# EAGLE design NinjaScanSlim (EAGLE 4.16)
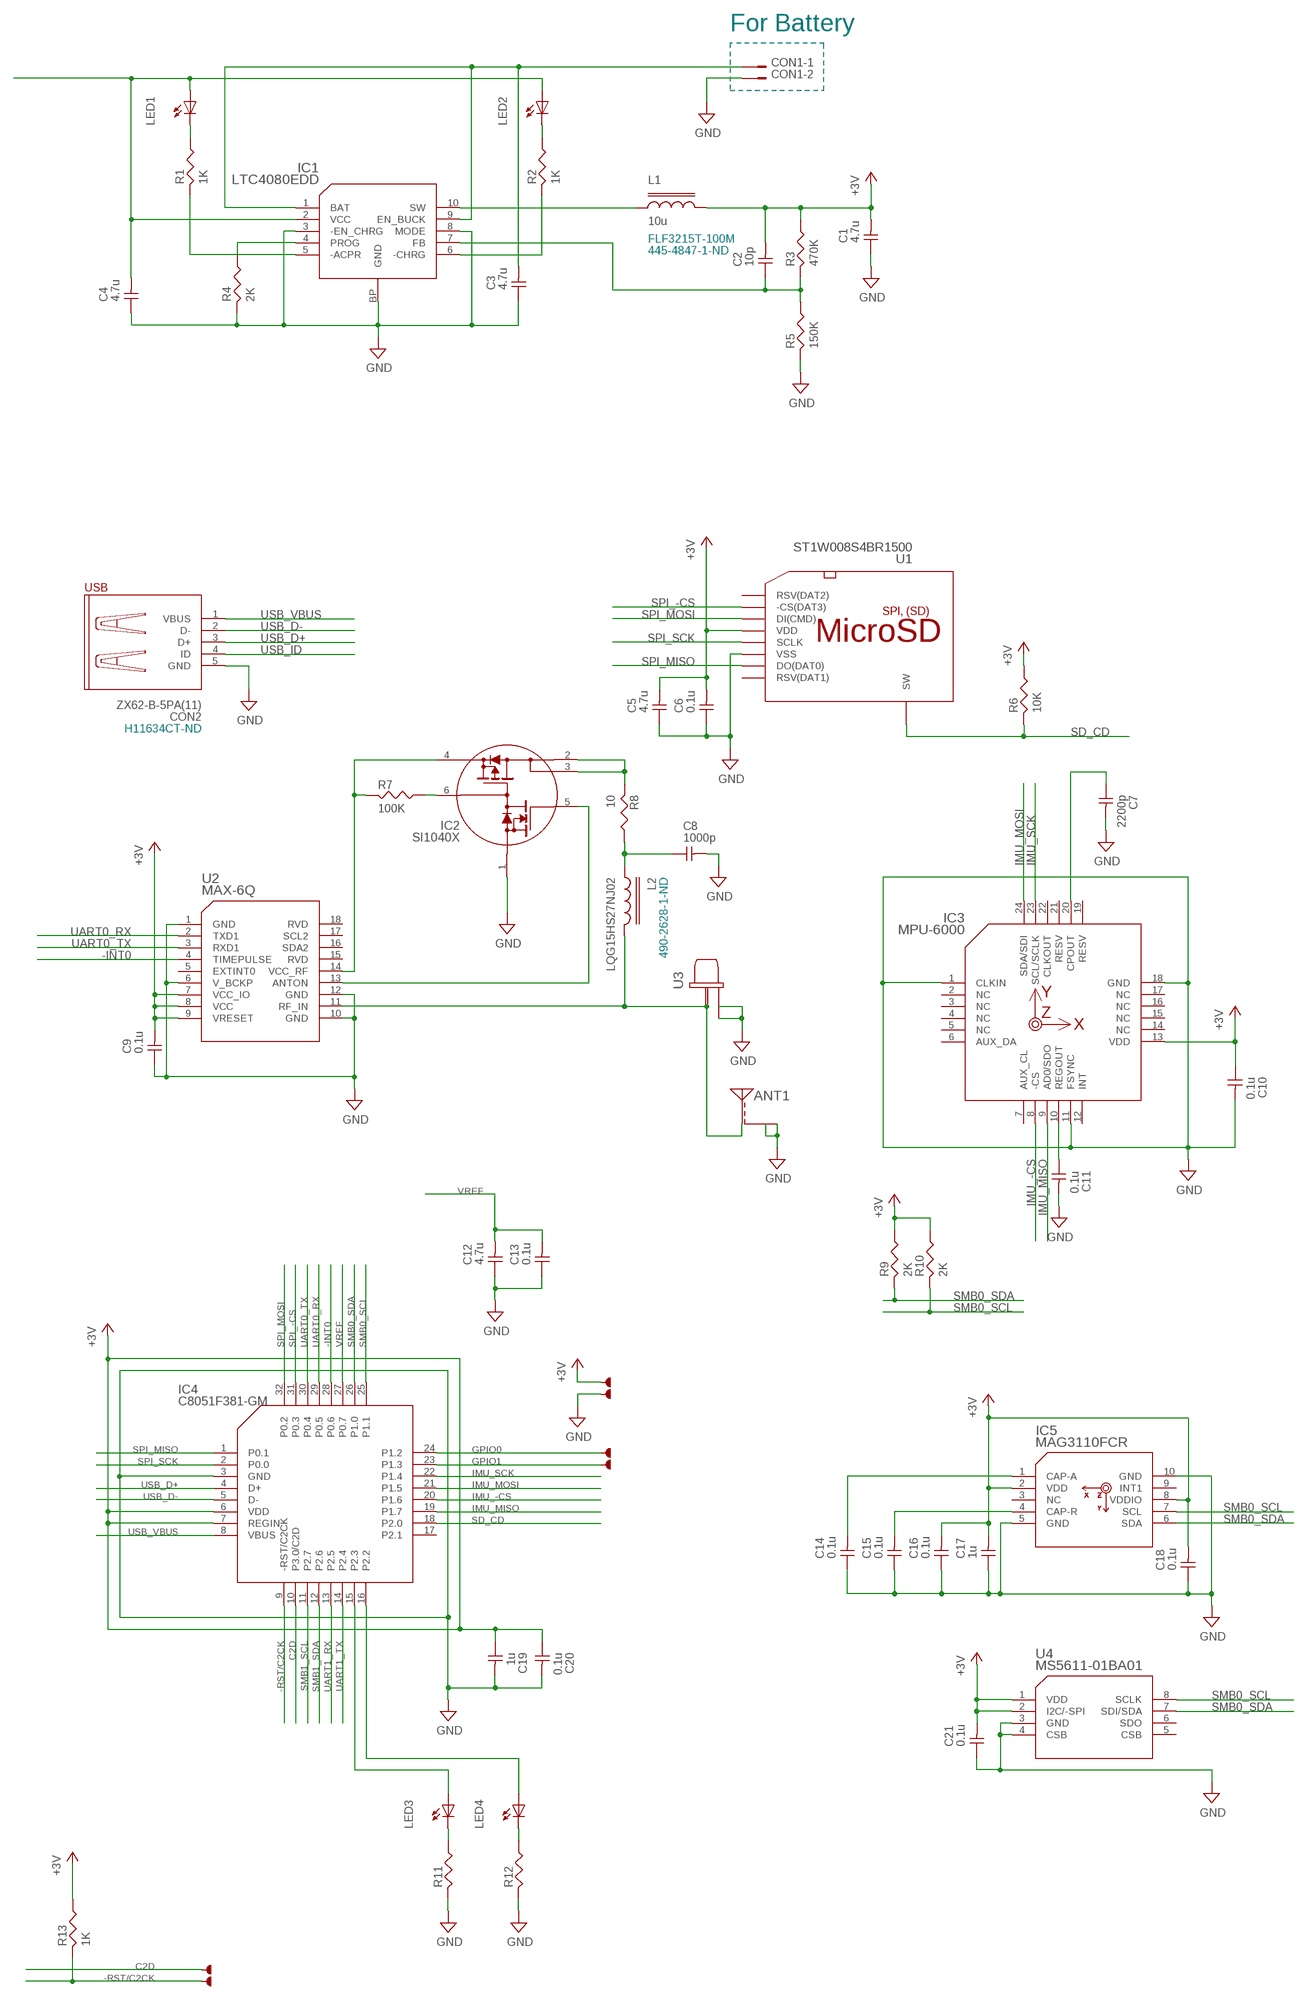
[diagram p0: schematic, sheet 1]

## Parts
ANT1  W3011A(M)  [W3011A-MIRROR]
C1  4.7u  C1608  [1608]
C2  10p  C1005  [1005]
C3  4.7u  C1608  [1608]
C4  4.7u  C1608  [1608]
C5  4.7u  C1608  [1608]
C6  0.1u  C1005  [1005]
C7  2200p  C1005  [1005]
C8  1000p  C1005  [1005]
C9  0.1u  C1005  [1005]
C10  0.1u  C1005  [1005]
C11  0.1u  C1005  [1005]
C12  4.7u  C1608  [1608]
C13  0.1u  C1005  [1005]
C14  0.1u  C1005  [1005]
C15  0.1u  C1005  [1005]
C16  0.1u  C1005  [1005]
C17  1u  C1005  [1005]
C18  0.1u  C1005  [1005]
C19  1u  C1005  [1005]
C20  0.1u  C1005  [1005]
C21  0.1u  C1005  [1005]
CON1  JST_ZH-2B(MM)  [JST_ZH-2B(MM)]
CON2  ZX62-B-5PA(11)  ZX62-AB-5PA  [ZX62-AB-5PA]
IC1  LTC4080EDD  [DFN10BP]
IC2  SI1040X  [SC89-6]
IC3  MPU-6000  [QFN24]
IC4  C8051F381-GM  C8051F341_32-GM  [QFN32]
IC5  MAG3110FCR  [DFN10]
L1  10u  L3225  [3225]
L2  LQG15HS27NJ02  L1005  [1005]
LED1  LED1608  [1608D]
LED2  LED1608  [1608D]
LED3  LED1608  [1608D]
LED4  LED1608  [1608D]
PAD1  PAD(20X20)  [PAD_20X20]
PAD2  PAD(20X20)  [PAD_20X20]
PAD3  PAD(20X20)  [PAD_20X20]
PAD4  PAD(20X20)  [PAD_20X20]
PAD5  PAD(40X40)  [PAD_40X40]
PAD6  PAD(40X40)  [PAD_40X40]
R1  1K  R1005  [1005]
R2  1K  R1005  [1005]
R3  470K  R1005  [1005]
R4  2K  R1005  [1005]
R5  150K  R1005  [1005]
R6  10K  R1005  [1005]
R7  100K  R1005  [1005]
R8  10  R1005  [1005]
R9  2K  R1005  [1005]
R10  2K  R1005  [1005]
R11  R1005  [1005]
R12  R1005  [1005]
R13  1K  R1005  [1005]
U1  ST1W008S4BR1500  [ST1W008S4BR1500]
U2  MAX-6Q  [MAX]
U3  U.FL  [U.FL]
U4  MS5611-01BA01  [LGA8]

## Nets
+3V: C1.P$2 C2.P$2 C5.P$2 C6.P$2 C9.P$2 C10.P$1 C16.P$2 C17.P$2 C18.P$2 C19.P$1 C20.P$1 C21.P$2 IC3.13(VDD) IC4.6(VDD) IC4.7(REGIN) IC5.2(VDD) IC5.8(VDDIO) L1.2 PAD1.P R3.P$1 R6.P$1 R9.P$1 R10.P$1 R13.P$1 U1.4(VDD) U2.7(VCC_IO) U2.8(VCC) U2.9(VRESET) U4.1(VDD) U4.2(I2C/-SPI)
-INT0: IC4.28(P0.6) U2.4(TIMEPULSE)
-RST/C2CK: IC4.9(-RST/C2CK) PAD6.P R13.P$2
C2D: IC4.10(P3.0/C2D) PAD5.P
GND: ANT1.GND@1(GND) ANT1.GND@2(GND) C1.P$1 C3.P$1 C4.P$1 C5.P$1 C6.P$1 C7.P$2 C8.P$2 C9.P$1 C10.P$2 C11.P$2 C12.P$1 C13.P$1 C14.P$1 C15.P$1 C16.P$1 C17.P$1 C18.P$1 C19.P$2 C20.P$2 C21.P$1 CON1.2 CON2.5(GND) IC1.3(-EN_CHRG) IC1.8(MODE) IC1.BP(GND) IC2.1(R2) IC3.1(CLKIN) IC3.11(FSYNC) IC3.18(GND) IC4.3(GND) IC5.5(GND) IC5.10(GND) PAD2.P R4.P$2 R5.P$2 R11.P$2 R12.P$2 U1.6(VSS) U2.1(GND) U2.6(V_BCKP) U2.10(GND) U2.12(GND) U3.GND@1(GND) U3.GND@2(GND) U4.3(GND) U4.4(CSB)
GPIO0: IC4.24(P1.2) PAD3.P
GPIO1: IC4.23(P1.3) PAD4.P
IMU_-CS: IC3.8(-CS) IC4.20(P1.6)
IMU_MISO: IC3.9(AD0/SDO) IC4.19(P1.7)
IMU_MOSI: IC3.24(SDA/SDI) IC4.21(P1.5)
IMU_SCK: IC3.23(SCL/SCLK) IC4.22(P1.4)
N$1: C11.P$1 IC3.10(REGOUT)
N$2: LED3.K R11.P$1
N$3: C7.P$1 IC3.20(CPOUT)
N$4: IC4.15(P2.3) LED3.A
N$5: IC4.16(P2.2) LED4.A
N$6: C8.P$1 L2.P$1 R8.P$1
N$7: ANT1.SIG(C) L2.P$2 U2.11(RF_IN) U3.SIG(C)
N$8: IC2.4(S2) R7.P$2 U2.14(VCC_RF)
N$9: LED1.K R1.P$1
N$10: C3.P$2 CON1.1 IC1.1(BAT) IC1.9(EN_BUCK)
N$11: LED2.K R2.P$1
N$12: IC1.4(PROG) R4.P$1
N$13: IC2.5(ON_OFF) U2.13(ANTON)
N$14: IC1.10(SW) L1.1
N$15: C2.P$1 IC1.7(FB) R3.P$2 R5.P$1
N$16: IC1.5(-ACPR) R1.P$2
N$17: IC1.6(-CHRG) R2.P$2
N$18: IC2.6(R1C1) R7.P$1
N$20: LED4.K R12.P$1
N$21: IC2.2(D2) IC2.3(D2) R8.P$2
N$22: C14.P$2 IC5.1(CAP-A)
N$29: C15.P$2 IC5.4(CAP-R)
SD_CD: IC4.18(P2.0) R6.P$2 U1.SW
SMB0_SCL: IC4.25(P1.1) IC5.7(SCL) R10.P$2 U4.8(SCLK)
SMB0_SDA: IC4.26(P1.0) IC5.6(SDA) R9.P$2 U4.7(SDI/SDA)
SMB1_SCL: IC4.11(P2.7)
SMB1_SDA: IC4.12(P2.6)
SPI_-CS: IC4.31(P0.3) U1.2(-CS(DAT3))
SPI_MISO: IC4.1(P0.1) U1.7(DO(DAT0))
SPI_MOSI: IC4.32(P0.2) U1.3(DI(CMD))
SPI_SCK: IC4.2(P0.0) U1.5(SCLK)
UART0_RX: IC4.29(P0.5) U2.2(TXD1)
UART0_TX: IC4.30(P0.4) U2.3(RXD1)
UART1_RX: IC4.13(P2.5)
UART1_TX: IC4.14(P2.4)
USB_D+: CON2.3(D+) IC4.4(D+)
USB_D-: CON2.2(D-) IC4.5(D-)
USB_ID: CON2.4(ID)
USB_VBUS: C4.P$2 CON2.1(VBUS) IC1.2(VCC) IC4.8(VBUS) LED1.A LED2.A
VREF: C12.P$2 C13.P$2 IC4.27(P0.7)
Unconnected: IC3.2(NC) IC3.3(NC) IC3.4(NC) IC3.5(NC) IC3.6(AUX_DA) IC3.7(AUX_CL) IC3.12(INT) IC3.14(NC) IC3.15(NC) IC3.16(NC) IC3.17(NC) IC3.19(RESV) IC3.21(RESV) IC3.22(CLKOUT) IC4.17(P2.1) IC5.3(NC) IC5.9(INT1) U1.1(RSV(DAT2)) U1.8(RSV(DAT1)) U2.5(EXTINT0) U2.15(RVD) U2.16(SDA2) U2.17(SCL2) U2.18(RVD) U4.5(CSB) U4.6(SDO)

## Notes on the sheet
- For Battery
- FLF3215T-100M
- 445-4847-1-ND
- H11634CT-ND
- 490-2628-1-ND

## Power pins joined to a net without a drawn wire
GND: CON2.GUIDE@L1(GND) CON2.GUIDE@L3(GND) CON2.GUIDE@R1(GND) CON2.GUIDE@R3(GND) U1.GND@1(GND) U1.GND@2(GND) U1.GND@3(GND) U1.GND@4(GND)

## Library data of the parts
ANT1 = gps:W3011: W3011 1.575 GHz GPS Ceramic Chip Antenna
C1-C21 = additional:C: Capacitor (Non-Polar)
CON1 = additional:JST_ZH-2*: JST_ZH-2 1.5mm pitch 2-pins Connector.
CON2 = additional:ZX62-AB-5PA: USB Micro-AB Connector
IC1 = main:LTC4080: LTC4080 500mA Standalone Li-Ion Charger with Integrated 300mA Synchronous Buck
IC2 = additional:SI1040X: Si1040X Load Switch with Level-Shift by Vishay
IC3 = sensor:MPU-6000: MPU-6000 Motion Processing Unit, 6 + 3 DOF inertial sensor unit
IC4 = main:C8051F34*_32: C8051F342/3/6/7 C8051F381/3/5/7 Full Speed USB Flash MCU 32 pins
IC5 = main:MAG3110: MAG3110 Three-Axis, Digital Magnetometer
L1 L2 = additional:L: Inductor
LED1-LED4 = additional:LED: Light Emitting Diode
PAD1-PAD6 = additional:PAD: PAD
R1-R13 = additional:R: Resistance
U1 = additional:ST1W008S4BR1500: ST1W008S4BR1500 MicroSD socket.
U2 = gps:MAX-6*: MAX-6* u-blox GPS Receiver Module
U3 = gps:U.FL: Hirose U.FL SMT low profile coaxicial connector
U4 = sensor:MS5611-01BA*: MS5611-01BA01 Barometric Pressure Sensor, with LCP(01) / metal(03) cap

## Board
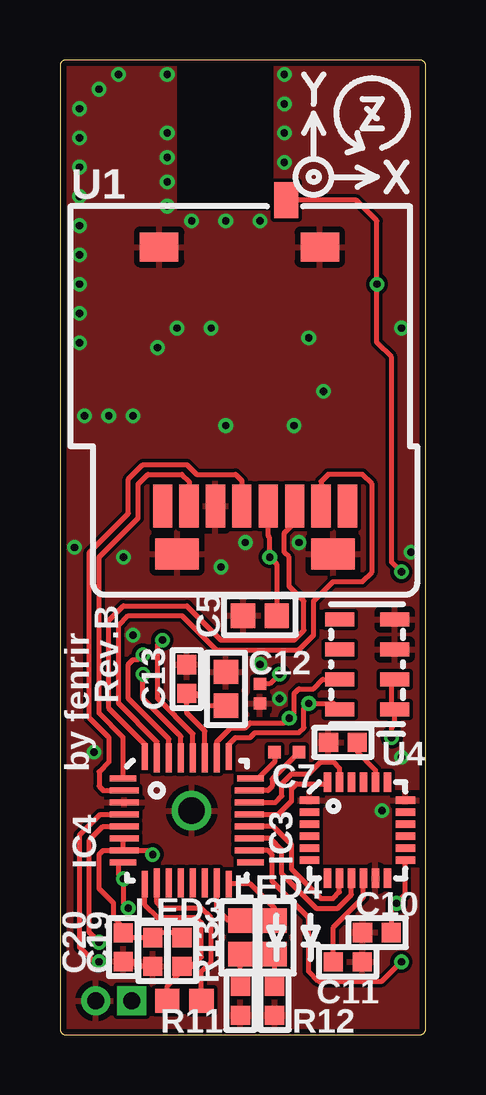
[diagram p1: board, top side]
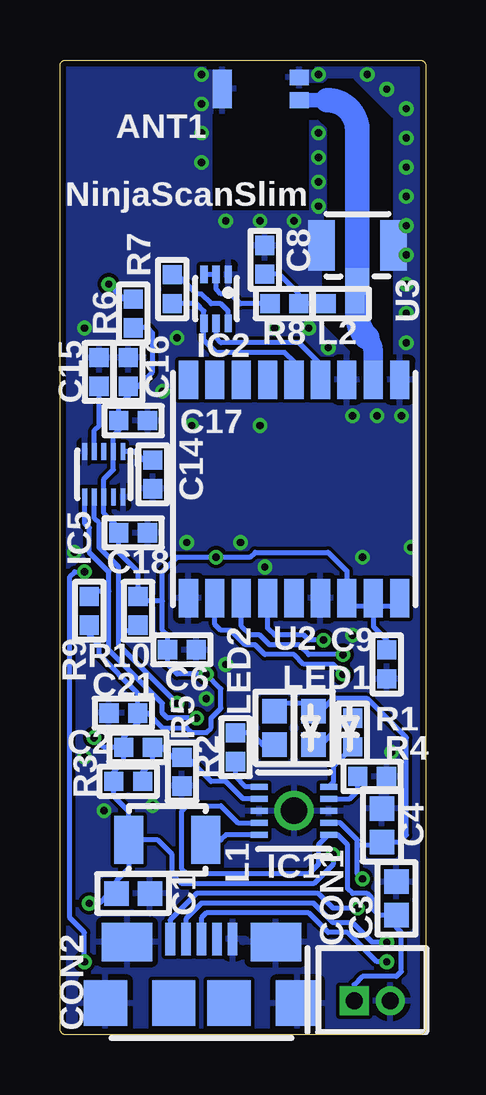
[diagram p2: board, bottom side, seen from below]

Size 15.24 x 40.64 mm. Coordinates in mm from the lower left corner, seen from the top.
Outline: 0.25,40.64 arc90 0,40.39 0,0.25 arc90 0.25,0 14.99,0 arc90 15.24,0.25 15.24,40.39 arc90 14.99,40.64 0.25,40.64
Copper layers (1*16): Top 0.035mm / dielectric 1.5mm / Bottom 0.035mm
Design rules "Fusion_eagle_rule_v1.1": minimum track width 6mil, minimum drill 12mil, track to track 6mil, track to pad 6mil, pad to pad 6mil, via to via 6mil, smd to smd 0mil, copper to edge 10mil, drill to drill 10mil, minimum pad ring 10mil, minimum via ring 6mil, stop-mask expansion 2mil, vias tented up to drill 100mil, thermal gap 10mil
bRestrict: area 1.4,28.2 to 4.9,39.8; area 3.5,31.1 to 4.9,38.8; area 2.8,28.2 to 4.3,29.9

### Footprints (pad centres in the part's own frame; a part is rotated, then mirrored left to right if it is on the bottom)
W3011A-MIRROR = smd 0.8 x 1.6: GND@1 3.6,1.2 | smd 0.8 x 0.65: GND@2 0.4,0.725; SIG 0.4,1.675
1608 = smd 1.016 x 1.016: P$1 -0.7,0; P$2 0.7,0
1005 = smd 0.8 x 0.8: P$1 -0.6,0; P$2 0.6,0
JST_ZH-2B(MM) = drill 0.7 pad 1.118 square: 1 -0.75,0 | drill 0.7 pad 1.118 round: 2 0.75,0
ZX62-AB-5PA = smd 0.4 x 1.35: 1 -1.3,2.675; 2 -0.65,2.675; 3 0,2.675; 4 0.65,2.675; 5 1.3,2.675 | smd 2.1 x 1.6: GUIDE@L1 -3.1,2.55; GUIDE@R1 3.1,2.55 | smd 1.8 x 1.9: GUIDE@L2 -1.15,0; GUIDE@L3 -4,0; GUIDE@R2 1.15,0; GUIDE@R3 4,0
DFN10BP = smd 0.7 x 0.25: 1 -1.45,1; 2 -1.45,0.5; 3 -1.45,0; 4 -1.45,-0.5; 5 -1.45,-1; 6 1.45,-1; 7 1.45,-0.5; 8 1.45,0; 9 1.45,0.5; 10 1.45,1 | drill 1.1 pad 1.4 round: BP 0,0
SC89-6 = smd 0.305 x 0.737: 1 -0.508,-1.016; 2 0,-1.016; 3 0.508,-1.016; 4 0.508,1.016; 5 0,1.016; 6 -0.508,1.016
QFN24 = smd 0.8 x 0.32: 1 -2,1.25; 2 -2,0.75; 3 -2,0.25; 4 -2,-0.25; 5 -2,-0.75; 6 -2,-1.25; 13 2,-1.25; 14 2,-0.75; 15 2,-0.25; 16 2,0.25; 17 2,0.75; 18 2,1.25 | smd 0.32 x 0.8: 7 -1.25,-2; 8 -0.75,-2; 9 -0.25,-2; 10 0.25,-2; 11 0.75,-2; 12 1.25,-2; 19 1.25,2; 20 0.75,2; 21 0.25,2; 22 -0.25,2; 23 -0.75,2; 24 -1.25,2
QFN32 = smd 1.1 x 0.25: 1 -2.65,1.75; 8 -2.65,-1.75; 17 2.65,-1.75; 24 2.65,1.75 | smd 1.2 x 0.25: 2 -2.6,1.25; 3 -2.6,0.75; 4 -2.6,0.25; 5 -2.6,-0.25; 6 -2.6,-0.75; 7 -2.6,-1.25; 18 2.6,-1.25; 19 2.6,-0.75; 20 2.6,-0.25; 21 2.6,0.25; 22 2.6,0.75; 23 2.6,1.25 | smd 0.25 x 1.1: 9 -1.75,-2.65; 16 1.75,-2.65; 25 1.75,2.65; 32 -1.75,2.65 | smd 0.25 x 1.2: 10 -1.25,-2.6; 11 -0.75,-2.6; 12 -0.25,-2.6; 13 0.25,-2.6; 14 0.75,-2.6; 15 1.25,-2.6; 26 1.25,2.6; 27 0.75,2.6; 28 0.25,2.6; 29 -0.25,2.6; 30 -0.75,2.6; 31 -1.25,2.6
DFN10 = smd 0.7 x 0.2: 1 -0.95,0.8; 2 -0.95,0.4; 3 -0.95,0; 4 -0.95,-0.4; 5 -0.95,-0.8; 6 0.95,-0.8; 7 0.95,-0.4; 8 0.95,0; 9 0.95,0.4; 10 0.95,0.8
3225 = smd 1.2 x 2: 1 -1.6,0; 2 1.6,0
1608D = smd 1.016 x 1.016: A -0.7,0; K 0.7,0
PAD_20X20 = smd 0.508 x 0.508: P 0,0
PAD_40X40 = smd 1.016 x 1.016: P 0,0
ST1W008S4BR1500 = smd 1.8 x 0.8: 1 -12.5,-3.85; 2 -12.5,-2.75; 3 -12.5,-1.65; 4 -12.5,-0.55; 5 -12.5,0.55; 6 -12.5,1.65; 7 -12.5,2.75; 8 -12.5,3.85 | smd 1.2 x 1.6: GND@1 -1.7,-2.7; GND@2 -1.7,4 | smd 1.3 x 1.8: GND@3 -14.5,-3.25; GND@4 -14.5,3.25 | smd 1.5 x 1: SW 0.25,-1.3
MAX = smd 1.6 x 0.8: 1 4.55,-4.4; 2 4.55,-3.3; 3 4.55,-2.2; 4 4.55,-1.1; 5 4.55,0; 6 4.55,1.1; 7 4.55,2.2; 8 4.55,3.3; 9 4.55,4.4; 10 -4.55,4.4; 11 -4.55,3.3; 12 -4.55,2.2; 13 -4.55,1.1; 14 -4.55,0; 15 -4.55,-1.1; 16 -4.55,-2.2; 17 -4.55,-3.3; 18 -4.55,-4.4
U.FL = smd 1.1 x 2.1: GND@1 -1.5,0; GND@2 1.5,0 | smd 1 x 1.1: SIG 0,-1.5
LGA8 = smd 1.2 x 0.6: 1 -1.15,1.875; 2 -1.15,0.625; 3 -1.15,-0.625; 4 -1.15,-1.875; 5 1.15,-1.875; 6 1.15,-0.625; 7 1.15,0.625; 8 1.15,1.875

### Placement (x,y rotation side)
ANT1  4.88,40.64 180 bottom
C1  12.19,5.89 180 bottom
C2  11.99,11.99 180 bottom
C3  1.22,5.69 270 bottom
C4  1.83,8.74 270 bottom
C5  8.33,17.48 0 top
C6  10.16,16.05 180 bottom
C7  11.79,12.19 180 top
C8  6.71,32.31 90 bottom
C9  1.63,15.44 90 bottom
C10  13.21,4.27 180 top
C11  11.99,3.05 0 top
C12  6.91,14.43 270 top
C13  5.28,14.83 270 top
C14  11.38,23.37 90 bottom
C15  13.61,27.64 270 bottom
C16  12.4,27.64 270 bottom
C17  12.19,25.6 180 bottom
C18  12.19,20.93 180 bottom
C19  3.86,3.45 270 top
C20  2.64,3.66 270 top
C21  12.6,13.41 0 bottom
CON1  2.24,1.42 0 bottom
CON2  9.35,1.32 0 bottom
IC1  5.49,9.35 180 bottom
IC2  8.74,30.68 180 bottom
IC3  12.4,8.53 0 top
IC4  5.28,8.94 0 top
IC5  13.41,23.37 270 bottom
L1  10.77,8.13 180 bottom
L2  3.56,30.48 0 bottom
LED1  4.67,12.8 270 bottom
LED2  6.3,12.8 270 bottom
LED3  7.52,4.06 270 top
LED4  8.94,4.06 270 top
PAD1  8.33,14.63 0 top
PAD2  8.33,13.82 0 top
PAD3  8.94,11.79 0 top
PAD4  9.96,11.79 0 top
PAD5  5.89,1.42 0 top
PAD6  4.47,1.42 0 top
R1  3.05,12.6 270 bottom
R2  7.92,11.99 270 bottom
R3  12.4,10.57 0 bottom
R4  2.24,10.77 0 bottom
R5  10.16,10.97 270 bottom
R6  12.19,30.07 90 bottom
R7  10.57,31.09 270 bottom
R8  5.89,30.48 180 bottom
R9  14.02,17.68 90 bottom
R10  11.99,17.68 270 bottom
R11  7.52,1.42 270 top
R12  8.94,1.42 270 top
R13  5.08,3.45 270 top
U1  8.13,34.54 90 top
U2  5.49,22.76 270 bottom
U3  2.84,32.92 0 bottom
U4  12.8,15.44 180 top

### Tracks (layer width: path | path; a pad name or v marks a point on that pad's centre or on a via)
+3V  (via drill 0.3)
  Top 0.203: IC3.13 14.39,5.86 v14.02,5.49 13.81,5.27 C10.P$1 | v13.82,12.39 13.82,12.8 13.95,12.94 U4.1 13.82,13.7 13.82,14.68 U4.2 | IC4.7 3.69,7.69 v3.86,7.52 | IC4.7 1.8,7.69 1.63,7.52 1.63,6.1 2.23,5.49 2.23,4.88 2.64,4.47 C20.P$1 2.83,4.06 3.85,4.06 C19.P$1 4.07,4.27 4.87,4.27 R13.P$1 | IC4.7 2.64,7.73 2.64,8.15 IC4.6 | PAD1.P 8.74,14.63 v9.14,15.04 | U1.4 8.68,20.79 8.74,20.73 v8.74,19.91 9.03,19.62 C5.P$2
  Bottom 0.2: IC5.2 13.01,23.57 13.41,23.16 IC5.8 13.41,21.74
  Bottom 0.203: 13.41,21.74 12.79,21.12 C18.P$2 12.79,20.11 11.99,19.3 R10.P$1 11.79,18.09 10.97,18.09 | L1.2 12.37,9.32 12.99,9.95 R3.P$1 12.99,10.98 12.59,11.39 C2.P$2 | L1.2 12.37,6.93 12.89,6.41 C1.P$2 13.21,5.89 13.61,5.49 v14.02,5.49 | R9.P$1 14.02,16.66 13.61,16.26 13.61,15.85 12,14.23 C21.P$2 | v13.82,12.39 13.41,11.99 C2.P$2 | v3.86,7.52 3.86,7.11 4.67,6.3 10.16,6.3 10.57,6.71 10.57,7.52 11.18,8.13 L1.2 | C21.P$2 11.58,13.41 10.97,12.8 9.96,12.8 9.75,12.6 9.14,12.6 8.94,12.8 8.94,13.21 8.53,13.61 8.53,14.43 v9.14,15.04 10.36,15.04 10.76,15.43 C6.P$2 10.76,16.65 10.97,16.87 10.97,18.09 | 10.97,18.09 10.97,19.3 10.36,19.91 v8.74,19.91 7.32,19.91 7.11,20.12 4.06,20.12 3.29,19.34 U2.7 3.16,17.88 2.31,17.88 U2.8 | C21.P$2 12,12.99 12.59,12.4 C2.P$2 | IC5.2 13.01,24.99 12.79,25.21 C17.P$2 12.79,26.22 12.39,26.62 C16.P$2 11.98,27.04 11.38,27.64 11.38,29.26 11.59,29.47 R6.P$1 | U2.9 1.21,17.88 2.06,17.88 U2.8 | C9.P$2 1.63,16.46 2.19,17.02 U2.8
-INT0  (via drill 0.3)
  Top 0.203: IC4.28 5.53,12.55 4.06,14.02 4.06,16.26 v4.27,16.46
  Bottom 0.203: v4.27,16.46 4.88,16.46 5.08,16.66 6.3,16.66 6.59,16.95 U2.4
-RST/C2CK
  Top 0.203: PAD6.P 4.47,2.03 5.08,2.64 R13.P$2 5.5,2.85 5.89,3.25 5.89,4.67 5.69,4.88 4.06,4.88 3.53,5.41 IC4.9
C2D
  Top 0.203: IC4.10 4.03,5.52 4.27,5.28 5.89,5.28 6.3,4.88 6.3,3.05 5.89,2.64 PAD5.P
GND  (via drill 0.3)
  Top 0.203: C20.P$2 3.04,3.06 3.24,2.85 C19.P$2
  other vias: 3.05,16.66 11.38,9.55 9.75,25.4 8.33,15.44 9.14,14.02 14.22,11.58 14.63,20.12 7.72,20.52 1.42,11.79 6.71,19.51 3.05,25.81 2.64,19.91 14.22,29.46 10.97,26.82 6.91,25.4 9.96,20.52 1.02,25.81 0.81,28.85 0.81,30.07 0.81,36.17 4.88,29.46 6.3,29.46 10.36,29.06 2.03,25.81 4.47,34.54 9.35,37.59 0.81,34.95 4.06,28.65 0.61,20.32 4.47,35.56 4.47,36.58 4.47,37.59 9.35,36.37 9.35,38.81 9.35,40.03 4.47,40.03 2.44,40.03 1.63,39.42 0.81,37.39 0.81,38.61 5.49,33.93 8.33,33.93 6.91,33.93 0.81,33.73 0.81,32.51 0.81,31.29 13.41,9.35
  pour Top (rank 2): 0,40.64 0,0 15.24,0 15.24,40.64
  pour Bottom (rank 2): 0,40.64 15.24,40.64 15.24,0 0,0
  pour Bottom (no thermals): 1.22,31.5 0.41,31.5 0.41,34.34 1.22,34.34
  pour Bottom (no thermals): 5.28,31.5 4.47,31.5 4.47,34.34 5.28,34.34
  pour Bottom (no thermals): 9.35,40.13 9.35,38.4 8.94,38.4 8.94,38.81 8.53,38.81 8.53,40.13
  pour Bottom (no thermals): 5.08,39.73 4.06,39.73 4.06,40.13 5.08,40.13
GPIO0
  Top 0.203: PAD3.P 8.94,11.38 8.25,10.69 IC4.24
GPIO1
  Top 0.203: IC4.23 8.67,10.19 8.84,10.36 8.84,10.67 PAD4.P
IMU_-CS
  Top 0.203: IC4.20 8.89,8.69 9.65,7.92 9.65,6.91 10.87,5.69 11.38,5.69 11.64,5.96 IC3.8
IMU_MISO
  Top 0.203: IC4.19 8.78,8.19 9.25,7.72 9.25,6.71 10.67,5.28 11.58,5.28 12.14,5.85 IC3.9
IMU_MOSI
  Top 0.203: IC4.21 9.09,9.19 9.65,9.75 9.65,10.26 9.86,10.46 11.08,10.46 IC3.24
IMU_SCK
  Top 0.203: IC3.23 11.64,11.11 11.38,11.38 10.87,11.38 10.36,10.87 9.65,10.87 9.25,10.46 9.25,9.96 8.98,9.69 IC4.22
N$1
  Top 0.203: IC3.10 12.64,5.74 11.39,4.48 C11.P$1
N$2
  Top 0.203: R11.P$1 LED3.K
N$3
  Top 0.203: C7.P$1 12.39,11.79 13.14,11.04 IC3.20
N$4
  Top 0.203: IC4.15 6.53,5.25 7.02,4.76 LED3.A
N$5
  Top 0.203: IC4.16 7.93,6.29 8.94,5.28 LED4.A
N$6
  Bottom 0.203: L2.P$1 R8.P$1 5.29,30.9 6.11,31.71 C8.P$1
N$7
  Bottom 0.61: 4.12,38.97 ANT1.SIG
  Bottom 0.813: 2.85,30.48 L2.P$2 | U2.11 2.19,28.45 arc-45 2.44,29.06
  Bottom 1.016: 4.12,38.97 arc90 2.85,37.7 U3.SIG 2.85,30.48 2.85,29.99 arc-45 2.47,29.09 2.44,29.06
N$8
  Bottom 0.203: R7.P$2 10.56,30.48 9.55,30.48 9.25,30.18 IC2.4 9.25,28.96 8.74,28.45 5.89,28.45 5.49,28.04 U2.14
N$9
  Bottom 0.203: LED1.K 4.36,12.1 3.26,13.2 R1.P$1
N$10
  Bottom 0.203: IC1.9 7.83,8.85 8.53,9.55 9.96,9.55 10.16,9.35 10.16,6.91 9.96,6.71 4.88,6.71 4.47,7.11 4.47,7.92 IC1.1 3.67,8.35 3.25,7.92 3.25,6.1 3.05,5.89 2.44,5.89 2.23,5.69 2.23,5.28 1.94,4.99 C3.P$2 1.22,4.47 1.02,4.27 1.02,2.64 1.22,2.44 2.64,2.44 2.98,2.1 CON1.1
N$11
  Bottom 0.203: LED2.K 6.82,12.1 7.31,12.59 R2.P$1
N$12
  Bottom 0.203: IC1.4 3.16,9.85 2.83,10.17 R4.P$1
N$13
  Bottom 0.203: U2.13 4.39,27.96 5.28,28.85 8.53,28.85 8.74,29.06 IC2.5
N$14
  Bottom 0.203: IC1.10 8.31,8.35 8.53,8.13 L1.1
N$15
  Bottom 0.203: IC1.7 7.61,9.85 8.33,10.57 8.94,10.57 9.95,11.57 R5.P$1 10.56,11.57 10.97,11.99 C2.P$1 11.39,11.37 11.79,10.96 R3.P$2
N$16
  Bottom 0.203: IC1.5 3.86,10.52 3.86,11.19 R1.P$2
N$17
  Bottom 0.203: IC1.6 7.5,10.35 7.92,10.77 R2.P$2
N$18
  Bottom 0.203: IC2.6 8.23,30.18 8.53,30.48 8.94,30.48 9.35,30.89 9.55,30.89 10.35,31.69 R7.P$1
N$20
  Top 0.203: R12.P$1 LED4.K
N$21
  Bottom 0.203: R8.P$2 7.72,30.48 8.13,30.89 8.53,30.89 8.74,31.09 IC2.2 IC2.3
N$22
  Bottom 0.2: 12.13,24.32 IC5.1
  Bottom 0.203: C14.P$2 11.78,23.97 12.13,24.32
N$29
  Bottom 0.203: IC5.4 13.81,25.2 13.61,25.4 C15.P$2
SD_CD  (via drill 0.3)
  Top 0.203: IC4.18 8.67,7.69 8.84,7.52 8.84,6.4 10.36,4.88 10.36,2.64 10.77,2.23 13.41,2.23 v14.22,3.05 | v14.22,19.3 13.82,19.71 13.82,28.25 13.21,28.85 v13.21,31.29 13.21,33.93 12.35,34.79 U1.SW
  Bottom 0.203: v14.22,3.05 14.22,4.27 14.83,4.88 14.83,19.1 14.63,19.3 v14.22,19.3 | R6.P$2 12.59,30.67 v13.21,31.29
SMB0_SCL  (via drill 0.3)
  Top 0.203: IC4.25 7.03,12.11 7.32,12.39 7.92,12.39 8.13,12.6 9.96,12.6 10.16,12.8 10.16,13.61 v10.36,13.82 11.4,13.82 U4.8
  Bottom 0.2: 13.61,20.31 13.61,21.34 13.81,21.53 IC5.7
  Bottom 0.203: 13.61,20.31 12.8,19.51 12.8,16.87 | v10.36,13.82 12.8,16.26 12.8,16.87 | R10.P$2 12.2,16.87 12.8,16.87
SMB0_SDA  (via drill 0.3)
  Top 0.203: IC4.26 6.53,12.22 7.11,12.8 7.72,12.8 7.92,13.01 9.35,13.01 v9.55,13.21 9.75,13.41 9.75,14.22 9.96,14.43 10.57,14.43 10.96,14.82 U4.7
  Bottom 0.203: v9.55,13.21 10.77,13.21 10.97,13.41 10.97,13.82 13.21,16.05 13.21,18.49 | 13.21,18.49 13.21,19.3 14.02,20.12 14.02,21.13 14.21,21.32 IC5.6 | R9.P$2 13.81,18.49 13.21,18.49
SPI_-CS
  Top 0.203: IC4.31 4.03,12.22 2.44,13.82 2.44,17.07 2.85,17.48 5.08,17.48 6.5,16.05 9.96,16.05 10.57,16.66 10.57,18.09 11.38,18.9 12.6,18.9 13.01,19.3 13.01,22.96 12.6,23.37 11.18,23.37 10.88,23.07 U1.2
SPI_MISO
  Top 0.203: IC4.1 2.63,12.4 1.63,13.41 1.63,19.91 3.25,21.54 3.25,22.96 3.66,23.37 5.08,23.37 5.38,23.07 U1.7
SPI_MOSI
  Top 0.203: IC4.32 3.53,12.11 2.03,13.61 2.03,17.27 2.64,17.88 5.28,17.88 6.71,16.46 9.75,16.46 10.16,16.87 10.16,18.09 9.55,18.69 9.55,19.91 9.35,20.12 9.35,20.93 9.78,21.36 U1.3
SPI_SCK
  Top 0.203: IC4.2 1.8,10.19 1.63,10.36 1.63,10.97 2.03,11.38 2.03,12.39 1.22,13.21 1.22,20.12 2.85,21.74 2.85,23.16 3.45,23.77 5.28,23.77 5.69,23.37 7.32,23.37 7.58,23.11 U1.5
UART0_RX  (via drill 0.3)
  Top 0.203: IC4.29 5.03,12.44 3.45,14.02 v3.45,15.04
  Bottom 0.203: v3.45,15.04 3.86,15.44 5.08,15.44 5.49,15.85 6.71,15.85 7.11,16.26 7.52,16.26 8.13,16.87 8.53,16.87 8.79,17.12 U2.2
UART0_TX  (via drill 0.3)
  Top 0.203: IC4.30 4.53,12.33 2.85,14.02 2.85,15.44 3.05,15.65 3.25,15.65 v3.45,15.85
  Bottom 0.203: v3.45,15.85 4.88,15.85 5.28,16.26 6.5,16.26 6.91,16.66 7.32,16.66 7.69,17.03 U2.3
USB_D+  (via drill 0.3)
  Top 0.203: IC4.4 1.67,9.19 0.81,8.33 0.81,3.66 1.42,3.05 v1.63,3.05
  Bottom 0.203: v1.63,3.05 2.03,3.05 3.25,4.27 4.06,4.27 4.67,4.88 | 4.67,4.88 4.47,4.67 | 4.67,4.88 4.88,5.08 9.14,5.08 9.35,4.88 CON2.3
USB_D-  (via drill 0.3)
  Top 0.203: IC4.5 1.78,8.69 1.22,8.13 1.22,4.27 v1.63,3.86
  Bottom 0.203: v1.63,3.86 2.23,3.86 3.05,4.67 3.86,4.67 4.67,5.49 9.35,5.49 10,4.84 CON2.2
USB_VBUS  (via drill 0.3)
  Top 0.203: v2.85,5.28 2.64,5.49 v2.64,6.5 2.44,6.71 2.44,7.19 IC4.8
  Bottom 0.203: IC1.2 3.56,8.85 2.85,8.13 2.85,7.92 | v2.64,6.5 2.85,6.71 2.85,7.92 | CON2.1 10.65,4.8 9.55,5.89 4.47,5.89 3.86,5.28 v2.85,5.28 | LED2.A 5.98,13.82 4.99,13.82 LED1.A 4.38,13.5 3.86,14.02 2.44,14.02 0.81,12.39 0.81,8.33 1.11,8.04 C4.P$2 1.94,7.92 2.85,7.92
VREF
  Top 0.203: IC4.27 6.03,12.66 5.28,13.41 C13.P$2 5.68,14.23 6.19,13.73 C12.P$2

### Text on the board
tNames: Rev.B | by fenrir
bNames: NinjaScanSlim